# EAGLE schematic toolbox (EAGLE 9.5.1)
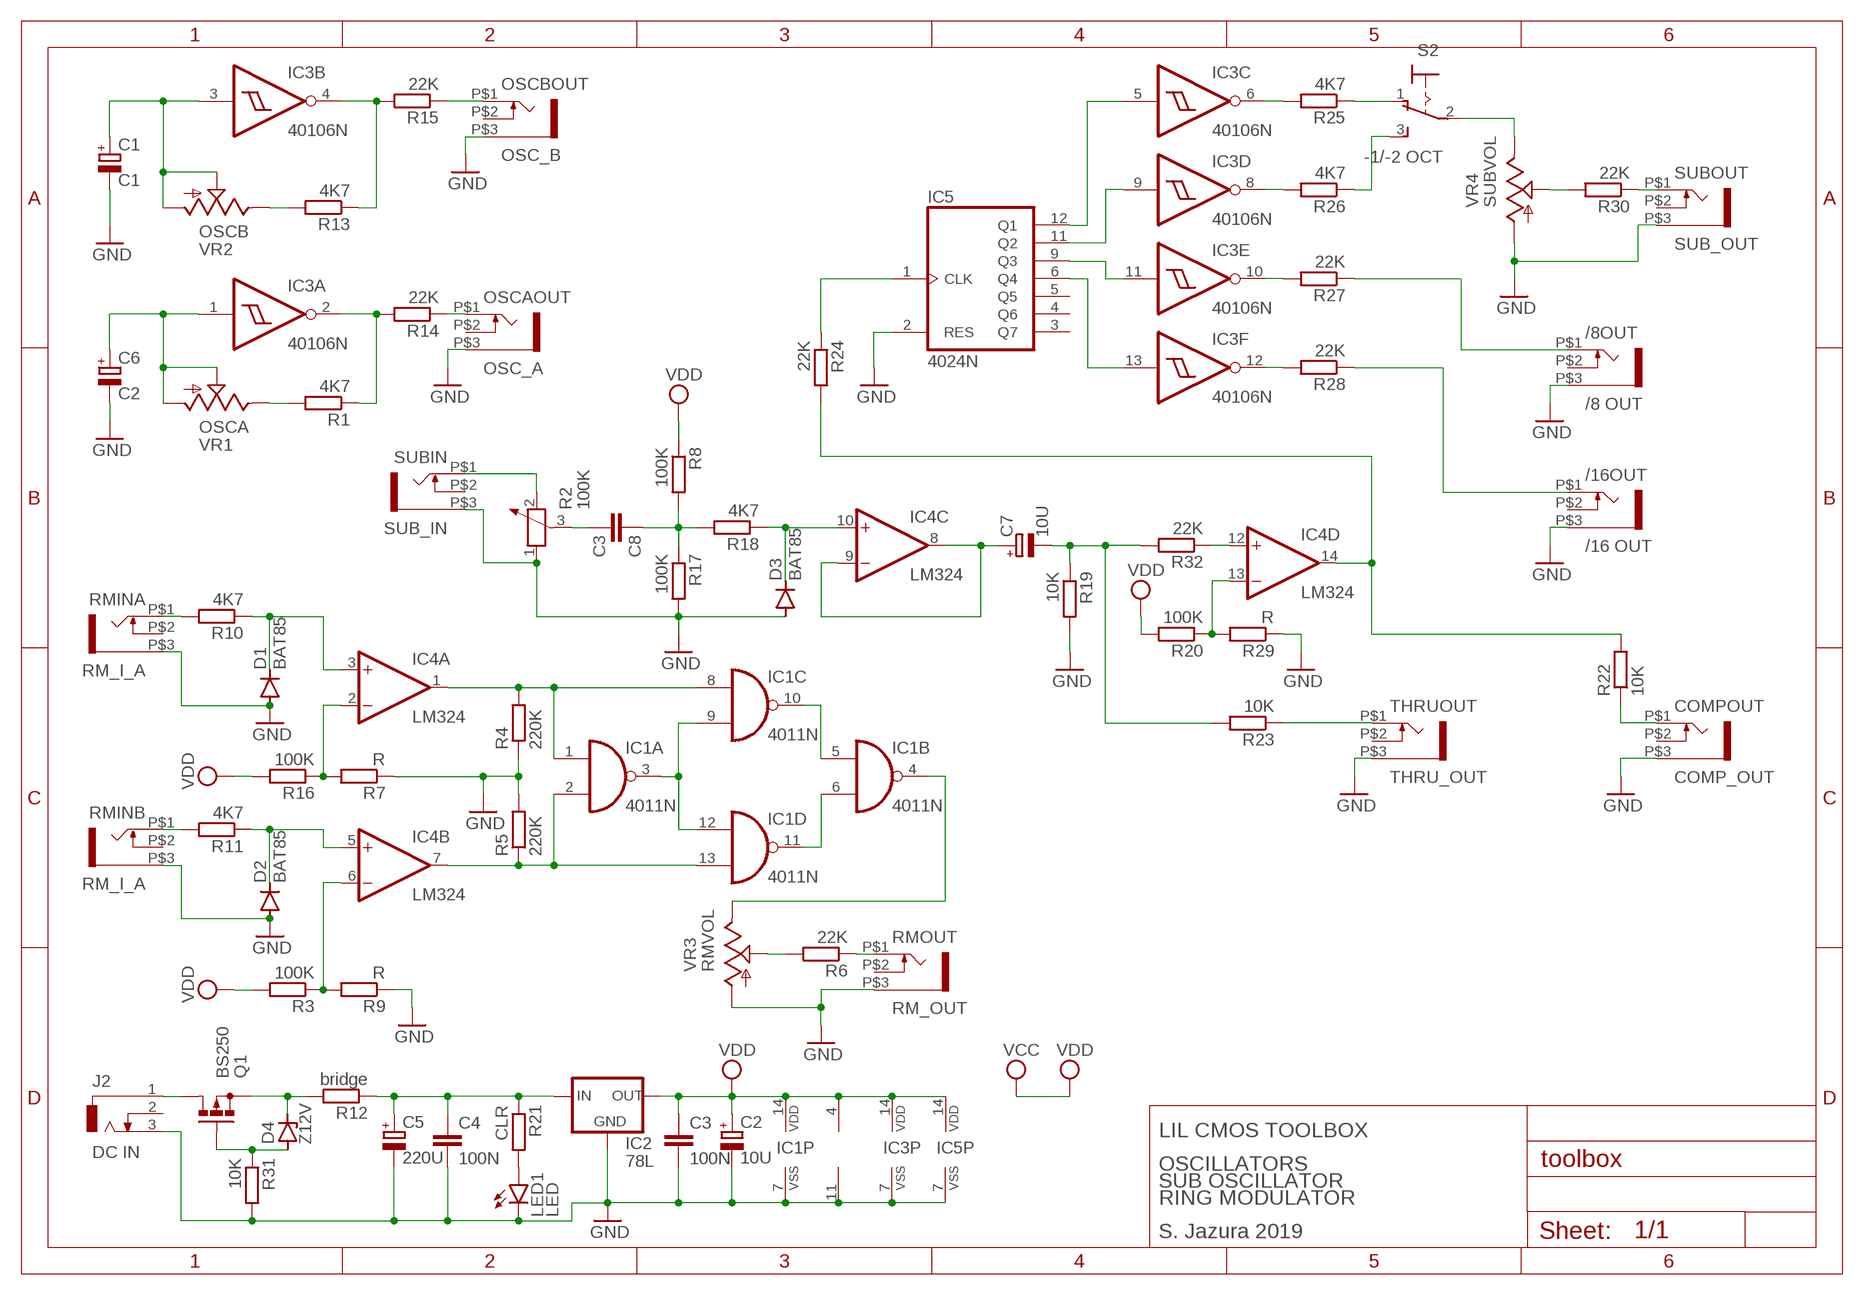
[diagram p0: schematic, sheet 1]

## Parts
/8OUT  /8 OUT  WQP-PJ301M-12_JACK  [WQP-PJ301M-12_JACK]
/16OUT  /16 OUT  WQP-PJ301M-12_JACK  [WQP-PJ301M-12_JACK]
C1  C1  0_CPOL-EUE2-4  [000_4MM_CAP_STANDARD]
C2  10U  0_CPOL-EUE2-4  [000_4MM_CAP_STANDARD]
C3  100N  C-EU000_5MM_DISC  [000_5MM_DISC_STANDARD]
C4  100N  C-EU000_5MM_DISC  [000_5MM_DISC_STANDARD]
C5  220U  CPOL-EUE2.5-7  [E2,5-7]
C6  C2  0_CPOL-EUE2-4  [000_4MM_CAP_STANDARD]
C7  10U  0_CPOL-EUE2-4  [000_4MM_CAP_STANDARD]
C8  C3  0_C-EU000_7,5MM_FOIL_STANDARD  [000_7,5MM_FOIL_STANDARD]
COMPOUT  COMP_OUT  WQP-PJ301M-12_JACK  [WQP-PJ301M-12_JACK]
D1  BAT85  1N4148DO35-7  [DO35-7]
D2  BAT85  1N4148DO35-7  [DO35-7]
D3  BAT85  1N4148DO35-7  [DO35-7]
D4  Z12V  BZV10  [DO34Z7]
IC1  4011N  [DIL14]
IC2  78L  78LXX  [000_78LXX_STANDARD]
IC3  40106N  [DIL14]
IC4  LM324  TL074P  [DIL14]
IC5  4024N  [DIL14]
J2  DC IN  DCJ0202  [DCJ0202]
LED1  LED  LED5MM  [LED5MM]
OSCAOUT  OSC_A  WQP-PJ301M-12_JACK  [WQP-PJ301M-12_JACK]
OSCBOUT  OSC_B  WQP-PJ301M-12_JACK  [WQP-PJ301M-12_JACK]
Q1  BS250  [SOT54E]
R1  4K7  R-EU_000_7,5MM_STANDARD  [000_7,5MM_STANDARD]
R2  100K  POTENTIOMETER_PT-10  [PT-10]
R3  100K  R-EU_000_7,5MM_STANDARD  [000_7,5MM_STANDARD]
R4  220K  R-EU_000_7,5MM_STANDARD  [000_7,5MM_STANDARD]
R5  220K  R-EU_000_7,5MM_STANDARD  [000_7,5MM_STANDARD]
R6  22K  R-EU_000_7,5MM_STANDARD  [000_7,5MM_STANDARD]
R7  R  R-EU_000_7,5MM_STANDARD  [000_7,5MM_STANDARD]
R8  100K  R-EU_000_7,5MM_STANDARD  [000_7,5MM_STANDARD]
R9  R  R-EU_000_7,5MM_STANDARD  [000_7,5MM_STANDARD]
R10  4K7  R-EU_000_7,5MM_STANDARD  [000_7,5MM_STANDARD]
R11  4K7  R-EU_000_7,5MM_STANDARD  [000_7,5MM_STANDARD]
R12  bridge  R-EU_000_7,5MM_STANDARD  [000_7,5MM_STANDARD]
R13  4K7  R-EU_000_7,5MM_STANDARD  [000_7,5MM_STANDARD]
R14  22K  R-EU_000_7,5MM_STANDARD  [000_7,5MM_STANDARD]
R15  22K  R-EU_000_7,5MM_STANDARD  [000_7,5MM_STANDARD]
R16  100K  R-EU_000_7,5MM_STANDARD  [000_7,5MM_STANDARD]
R17  100K  R-EU_000_7,5MM_STANDARD  [000_7,5MM_STANDARD]
R18  4K7  R-EU_000_7,5MM_STANDARD  [000_7,5MM_STANDARD]
R19  10K  R-EU_000_7,5MM_STANDARD  [000_7,5MM_STANDARD]
R20  100K  R-EU_000_7,5MM_STANDARD  [000_7,5MM_STANDARD]
R21  CLR  R-EU_000_7,5MM_STANDARD  [000_7,5MM_STANDARD]
R22  10K  R-EU_000_7,5MM_STANDARD  [000_7,5MM_STANDARD]
R23  10K  R-EU_000_7,5MM_STANDARD  [000_7,5MM_STANDARD]
R24  22K  R-EU_000_7,5MM_STANDARD  [000_7,5MM_STANDARD]
R25  4K7  R-EU_000_7,5MM_STANDARD  [000_7,5MM_STANDARD]
R26  4K7  R-EU_000_7,5MM_STANDARD  [000_7,5MM_STANDARD]
R27  22K  R-EU_000_7,5MM_STANDARD  [000_7,5MM_STANDARD]
R28  22K  R-EU_000_7,5MM_STANDARD  [000_7,5MM_STANDARD]
R29  R  R-EU_000_7,5MM_STANDARD  [000_7,5MM_STANDARD]
R30  22K  R-EU_000_7,5MM_STANDARD  [000_7,5MM_STANDARD]
R31  10K  R-EU_000_7,5MM_STANDARD  [000_7,5MM_STANDARD]
R32  22K  R-EU_000_7,5MM_STANDARD  [000_7,5MM_STANDARD]
RMINA  RM_I_A  WQP-PJ301M-12_JACK  [WQP-PJ301M-12_JACK]
RMINB  RM_I_A  WQP-PJ301M-12_JACK  [WQP-PJ301M-12_JACK]
RMOUT  RM_OUT  WQP-PJ301M-12_JACK  [WQP-PJ301M-12_JACK]
S2  -1/-2 OCT  SPDT_LUG_PCMOUNT  [M9040P]
SUBIN  SUB_IN  WQP-PJ301M-12_JACK  [WQP-PJ301M-12_JACK]
SUBOUT  SUB_OUT  WQP-PJ301M-12_JACK  [WQP-PJ301M-12_JACK]
THRUOUT  THRU_OUT  WQP-PJ301M-12_JACK  [WQP-PJ301M-12_JACK]
VR1  OSCA  9MM_SNAP-IN_POT_  [9MM_SNAP-IN_POT]
VR2  OSCB  9MM_SNAP-IN_POT_  [9MM_SNAP-IN_POT]
VR3  RMVOL  9MM_SNAP-IN_POT_  [9MM_SNAP-IN_POT]
VR4  SUBVOL  9MM_SNAP-IN_POT_  [9MM_SNAP-IN_POT]

## Nets
GND: /8OUT.P$3 /16OUT.P$3 C1.- C2.- C3.2 C4.2 C5.- C6.- COMPOUT.P$3 D1.A D2.A D3.A IC1.7(P:VSS) IC2.GND IC3.7(P:VSS) IC4.11(P:V-) IC5.2(RES) IC5.7(VSS) J2.3 LED1.K(C) OSCAOUT.P$3 OSCBOUT.P$3 R2.1 R4.1 R5.2 R7.1 R9.1 R17.2 R19.2 R29.1 R31.2 RMINA.P$3 RMINB.P$3 RMOUT.P$3 SUBIN.P$3 SUBOUT.P$3 THRUOUT.P$3 VR3.1(A) VR4.1(A)
N$1: IC1.4(B:O) VR3.3(E)
N$2: R6.1 RMOUT.P$1
N$3: IC4.13(D:-IN) R20.1 R29.2
N$4: IC1.3(A:O) IC1.9(C:I1) IC1.12(D:I0)
N$5: IC1.5(B:I0) IC1.10(C:O)
N$6: IC1.6(B:I1) IC1.11(D:O)
N$7: IC1.2(A:I1) IC1.13(D:I1) IC4.7(B:OUT) R5.1
N$8: IC1.1(A:I0) IC1.8(C:I0) IC4.1(A:OUT) R4.2
N$9: R6.2 VR3.2(S)
N$10: IC4.2(A:-IN) R7.2 R16.1
N$11: IC4.6(B:-IN) R3.1 R9.2
N$12: D1.C IC4.3(A:+IN) R10.1
N$13: J2.1 Q1.D
N$14: C6.+ IC3.1(A:I) VR1.1(A) VR1.2(S)
N$15: D2.C IC4.5(B:+IN) R11.1
N$16: C7.- R19.1 R23.2 R32.2
N$17: R1.2 VR1.3(E)
N$18: D4.C Q1.S R12.2
N$19: C4.1 C5.+ IC2.IN R12.1 R21.1
N$20: C7.+ IC4.8(C:OUT) IC4.9(C:-IN)
N$21: C1.+ IC3.3(B:I) VR2.1(A) VR2.2(S)
N$22: R13.2 VR2.3(E)
N$23: R2.2 SUBIN.P$1
N$24: C8.2 R2.3
N$25: IC3.2(A:O) R1.1 R14.2
N$26: C8.1 R8.2 R17.1 R18.2
N$27: D3.C IC4.10(C:+IN) R18.1
N$28: LED1.A R21.2
N$29: D4.A Q1.G R31.1
N$30: IC3.4(B:O) R13.1 R15.2
N$31: OSCAOUT.P$1 R14.1
N$32: OSCBOUT.P$1 R15.1
N$33: R10.2 RMINA.P$1
N$34: R11.2 RMINB.P$1
N$35: IC4.12(D:+IN) R32.1
N$36: R25.1 S2.1(O)
N$37: IC4.14(D:OUT) R22.2 R24.2
N$38: IC3.6(C:O) R25.2
N$39: COMPOUT.P$1 R22.1
N$40: R23.1 THRUOUT.P$1
N$41: IC5.1(CLK) R24.1
N$42: IC3.5(C:I) IC5.12(Q1)
N$43: IC3.9(D:I) IC5.11(Q2)
N$44: IC3.11(E:I) IC5.9(Q3)
N$45: IC3.13(F:I) IC5.6(Q4)
N$46: IC3.8(D:O) R26.2
N$47: IC3.10(E:O) R27.2
N$48: IC3.12(F:O) R28.2
N$50: /8OUT.P$1 R27.1
N$53: R26.1 S2.3(S)
N$56: /16OUT.P$1 R28.1
N$59: S2.2(P) VR4.3(E)
N$60: R30.2 VR4.2(S)
N$61: R30.1 SUBOUT.P$1
VDD: C2.+ C3.1 IC1.14(P:VDD) IC2.OUT IC3.14(P:VDD) IC4.4(P:V+) IC5.14(VDD) R3.2 R8.1 R16.2 R20.2 ; supply symbol labelled VCC
Unconnected: /8OUT.P$2 /16OUT.P$2 COMPOUT.P$2 IC5.3(Q7) IC5.4(Q6) IC5.5(Q5) J2.2 OSCAOUT.P$2 OSCBOUT.P$2 RMINA.P$2 RMINB.P$2 RMOUT.P$2 SUBIN.P$2 SUBOUT.P$2 THRUOUT.P$2

## Notes on the sheet
- LIL CMOS TOOLBOX
  
  OSCILLATORS
  SUB OSCILLATOR
  RING MODULATOR
  
  S. Jazura 2019

## Library data of the parts
/8OUT /16OUT COMPOUT OSCAOUT OSCBOUT RMINA RMINB RMOUT SUBIN SUBOUT THRUOUT = thonkiconn:WQP-PJ301M-12_JACK
C1 C2 C6 C7 = 000_mod_rcl:0_CPOL-EU: POLARIZED CAPACITOR, European symbol; SPICEPREFIX: C
C3 C4 = 000_mod_rcl:C-EU: CAPACITOR, European symbol; SPICEPREFIX: C
C5 = 000_mod_rcl:CPOL-EU: POLARIZED CAPACITOR, European symbol; SPICEPREFIX: C
C8 = 000_mod_rcl:0_C-EU: CAPACITOR, European symbol; SPICEPREFIX: C
D1-D3 = 000_mod_diode:1N4148: DIODE high speed (Philips)
D4 = 000_mod_diode:BZV10: Z DIODE
IC1 = 40xx:4011: Quad 2-input NAND
IC2 = 000_mod_v-reg:78LXX: VOLTAGE REGULATOR
IC3 = 40xx:40106: Hex SCHMITT TRIGGER
IC4 = linear:TL074: OP AMP
IC5 = 40xx:4024: 7-stage binary/ripple COUNTER
J2 = 000_synth_parts:DCJ0202: DC POWER JACK Source: DCJ0202.pdf; OC_FARNELL: unknown; OC_NEWARK: unknown
LED1 = 000_synth_parts:LED: LED OSRAM: - CHIPLED LG R971, LG N971, LY N971, LG Q971, LY Q971, LO R971, LY R971 LH N974, LH R974 LS Q976, LO Q976, LY Q976 LO Q996 - Hyper CHIPLED LW Q18S LB Q993, LB Q99A, LB R99A - SideLED LS A670, LO A670, LY A670, LG A670, LP A670 LB A673, LV A673, LT A673, LW A673 LH A674 LY A675 LS A676, LA A676, LO A676, LY A676, LW A676 LS A679, LY A679, LG A679 - Hyper Micro SIDELED® LS Y876, LA Y876, LO Y876, LY Y876 LT Y87S - SmartLED LW L88C, LW L88S LB L89C, LB L89S, LG L890 LS L89K, LO L89K, LY L89K LS L896, LA L896, LO L896, LY L896 - TOPLED LS T670, LO T670, LY T670, LG T670, LP T670 LSG T670, LSP T670, LSY T670, LOP T670, LYG T670 LG T671, LOG T671, LSG T671 LB T673, LV T673, LT T673, LW T673 LH T674 LS T676, LA T676, LO T676, LY T676, LB T676, LH T676, LSB T676, LW T676 LB T67C, LV T67C, LT T67C, LS T67K, LO T67K, LY T67K, LW E67C LS E67B, LA E67B, LO E67B, LY E67B, LB E67C, LV E67C, LT E67C LW T67C LS T679, LY T679, LG T679 LS T770, LO T770, LY T770, LG T770, LP T770 LB T773, LV T773, LT T773, LW T773 LH T774 LS E675, LA E675, LY E675, LS T675 LS T776, LA T776, LO T776, LY T776, LB T776 LHGB T686 LT T68C, LB T68C - Hyper Mini TOPLED® LB M676 - Mini TOPLED Santana® LG M470 LS M47K, LO M47K, LY M47K Source: http://www.osram.convergy.de LUXEON: - LUMILED® LXK2-PW12-R00, LXK2-PW12-S00, LXK2-PW14-U00, LXK2-PW14-V00 LXK2-PM12-R00, LXK2-PM12-S00, LXK2-PM14-U00 LXK2-PE12-Q00, LXK2-PE12-R00, LXK2-PE12-S00, LXK2-PE14-T00, LXK2-PE14-U00 LXK2-PB12-K00, LXK2-PB12-L00, LXK2-PB12-M00, LXK2-PB14-N00, LXK2-PB14-P00, LXK2-PB14-Q00 LXK2-PR12-L00, LXK2-PR12-M00, LXK2-PR14-Q00, LXK2-PR14-R00 LXK2-PD12-Q00, LXK2-PD12-R00, LXK2-PD12-S00 LXK2-PH12-R00, LXK2-PH12-S00 LXK2-PL12-P00, LXK2-PL12-Q00, LXK2-PL12-R00 Source: www.luxeon.com KINGBRIGHT: KA-3528ASYC Source: www.kingbright.com
Q1 = 000_synth_parts:BS250: P-CHANNEL MOS FET
R1 R3-R32 = 000_mod_rcl:R-EU_: RESISTOR, European symbol; SPICEPREFIX: R
R2 = 000_mod_rcl:POTENTIOMETER_: Potentiometer; SPICEMODEL: POT; SPICEPREFIX: X
S2 = 000_synth_parts:SPDT_LUG_PCMOUNT: TOGGLE SWITCH Marquardt
VR1-VR4 = MusicThingModular:9MM_SNAP-IN_POT: 9mm vertical snap-in pot, Alpha / Panasonic style

## Net classes
0 default: width 0.559 mm, clearance 0.508 mm